# Altium project Biocoin_Motherboard_v1.0.PrjPcb
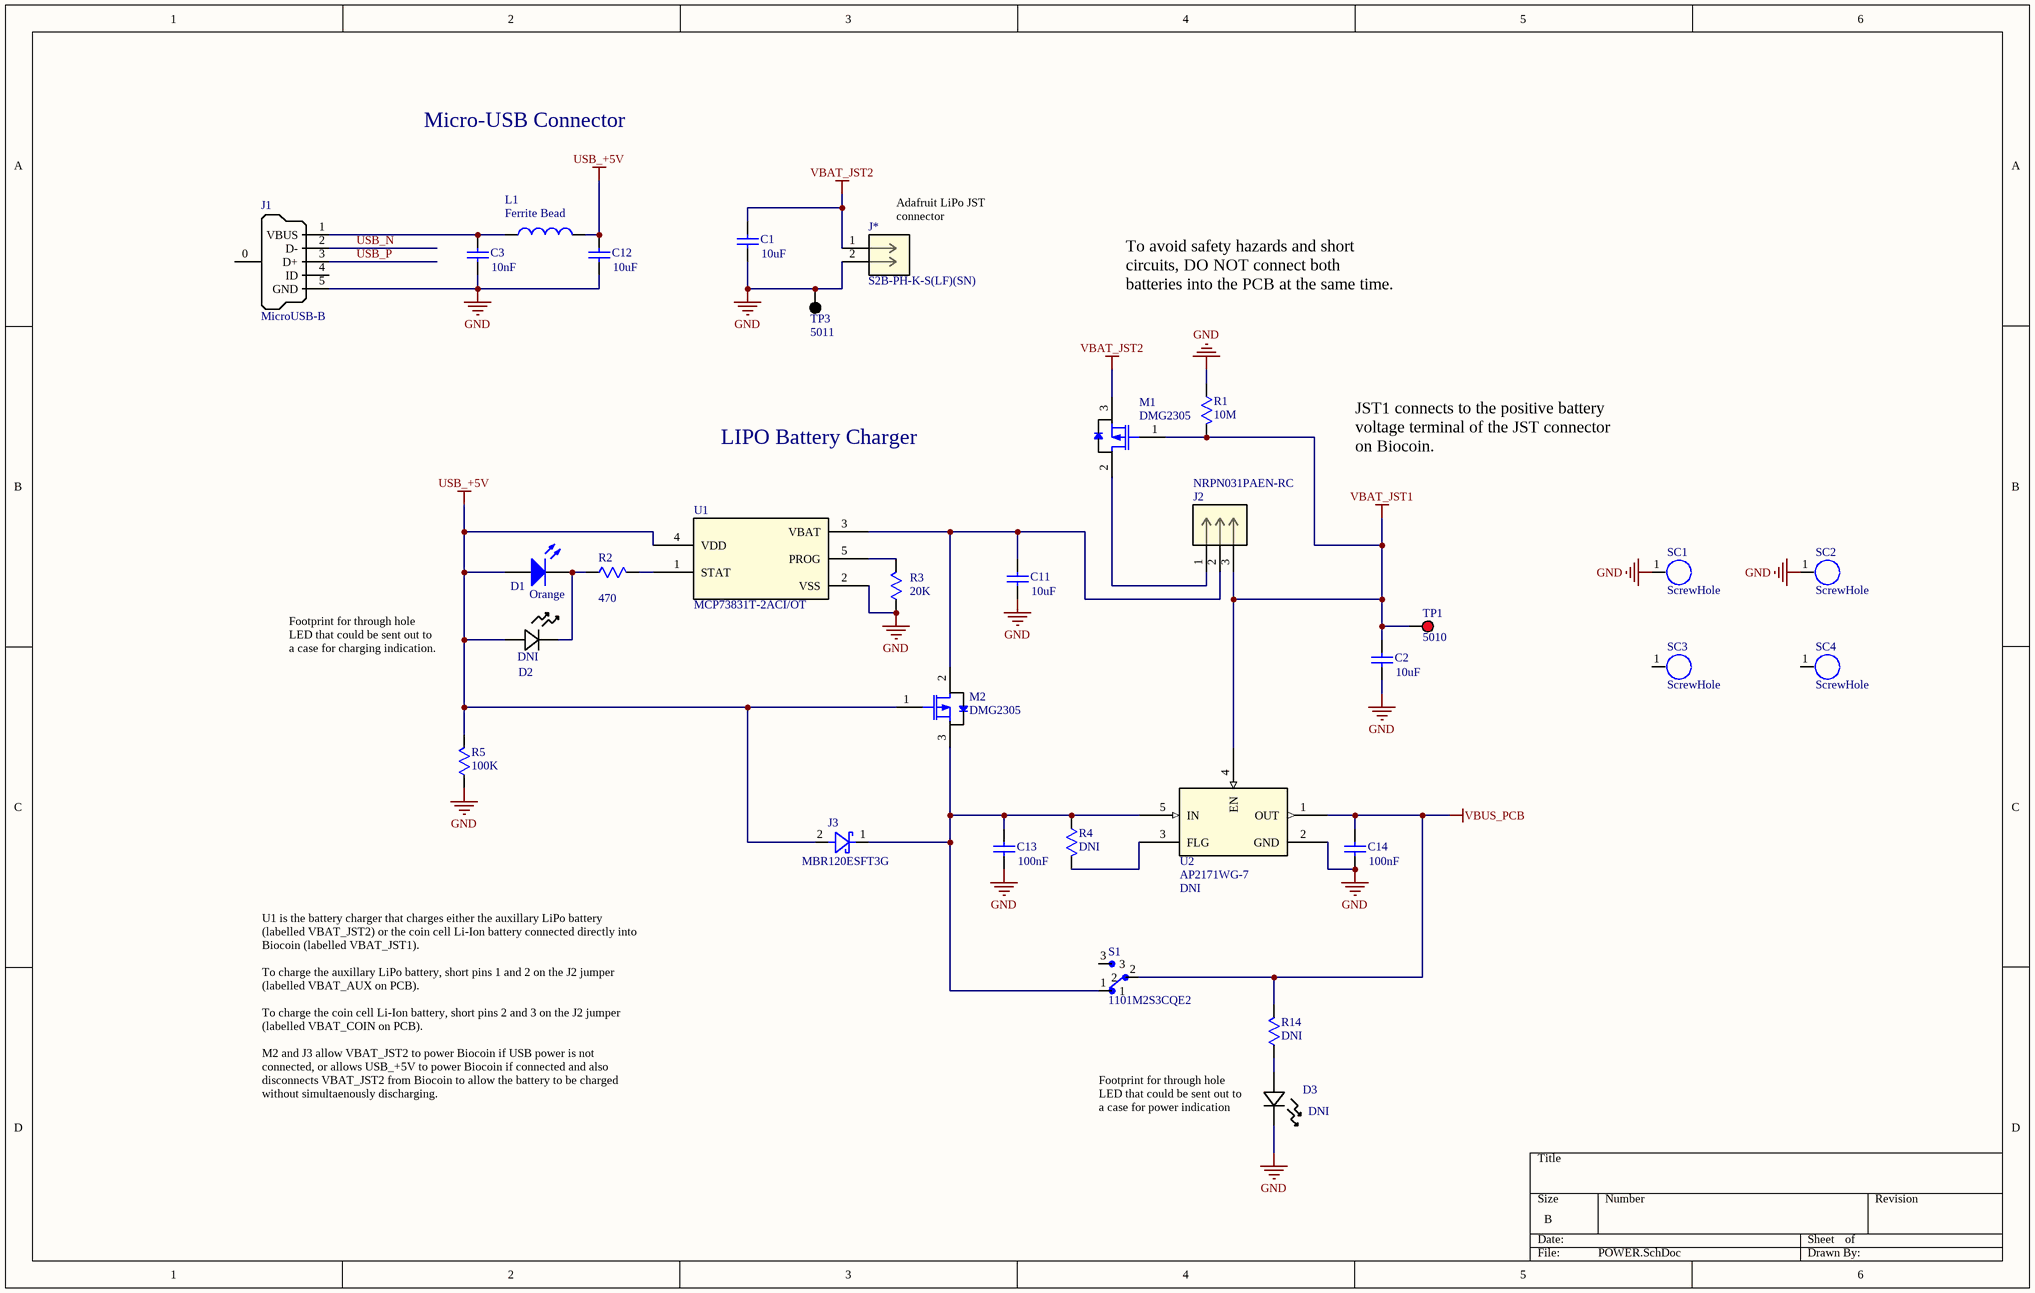
[diagram p0: POWER.SchDoc]
3 sheets, 71 parts. Net scope: global (net labels, ports and power ports of the same name join across sheets).
Board file: Biocoin_Motherboard.PcbDoc
Sheets:
  POWER.SchDoc
  DIGITAL_DATA.SchDoc
  ANALOG_DATA.SchDoc

## Sheet POWER.SchDoc
size B; SheetNumber: 1; SheetTotal: 3

### Parts
C1  value 10uF  [0805-CAP]  (hidden comment: CAP)
C2  value 10uF  [0805-CAP]  (hidden comment: CAP)
C3  value 10nF  [0805-CAP]  (hidden comment: CAP)
C11  value 10uF  [0805-CAP]  (hidden comment: CAP)
C12  value 10uF  [0805-CAP]  (hidden comment: CAP)
C13  value 100nF  [0805-CAP]  (hidden comment: CAP)
C14  value 100nF  [0805-CAP]  (hidden comment: CAP)
D1  Light Color: Orange  [0805-LED]  (hidden comment: LED SMD)
D2  Do Not Install: DNI  [LED_SLI-343D_ROM]  (hidden comment: SLI-343V8RC3F)
D3  Do Not Install: DNI  [LED_SLI-343D_ROM]  (hidden comment: SLI-343V8RC3F)
J1  MicroUSB-B  [MicroUSB-B]
J2  NRPN031PAEN-RC  [CONN_NRPN031_SUL]
J3  MBR120ESFT3G  [SDO_SOD-123FL_ONS-L]
J*  S2B-PH-K-S(LF)(SN)  [CONN_S2B-PH-K-S_JST]
L1  value Ferrite Bead  [0805-IND]  (hidden comment: IND)
M1  DMG2305  [SOT23-3-Lead]
M2  DMG2305  [SOT23-3-Lead]
R1  value 10M  [0805-RES]  (hidden comment: RES)
R2  value 470  [0805-RES]  (hidden comment: RES)
R3  value 20K  [0805-RES]  (hidden comment: RES)
R4  value DNI  [0805-RES]  (hidden comment: RES)
R5  value 100K  [0805-RES]  (hidden comment: RES)
R14  value DNI  [0805-RES]  (hidden comment: RES)
S1  1101M2S3CQE2  [SW_1101M2S3CQE2]
SC1  ScrewHole  [ScrowHole]
SC2  ScrewHole  [ScrowHole]
SC3  ScrewHole  [ScrowHole]
SC4  ScrewHole  [ScrowHole]
TP1  5010  [KSTN-5010_V]
TP3  5011  [KSTN-5011_V]
U1  MCP73831T-2ACI/OT  [SOT23-5]
U2  AP2171WG-7  value DNI  [SOT25_DIO-M]

### Nets
GND: C1.1 C2.1 C3.1 C11.1 C12.1 C13.1 C14.1 D3.1 J1.5(GND) J*.2 R1.1 R3.1 R5.1 SC1.1 SC2.1 TP3.1 U1.2(VSS) U2.2(GND)
USB_+5V: C12.2 D1.1(A) D2.2 J3.2 L1.2 M2.1(G) R5.2 U1.4(VDD)
VBAT_JST1: C2.2 J2.3 M1.1(G) R1.2 TP1.1 U2.4(EN)
VBAT_JST2: C1.2 J*.1 M1.3(D)
VBUS_PCB: C14.2 R14.2 S1.2 U2.1(OUT)
USB_N: J1.2(D-)
USB_P: J1.3(D+)
NetC3_2: C3.2 J1.1(VBUS) L1.1
NetC11_2: C11.2 J2.2 M2.2(S) U1.3(VBAT)
NetC13_2: C13.2 J3.1 M2.3(D) R4.1 S1.1 U2.5(IN)
NetD1_2: D1.2(K) D2.1 R2.1
NetD3_2: D3.2 R14.1
NetJ2_1: J2.1 M1.2(S)
NetR2_2: R2.2 U1.1(STAT)
NetR3_2: R3.2 U1.5(PROG)
NetR4_2: R4.2 U2.3(FLG)

Not connected (* = marked no-connect by the designer): J1 0(Shell) 4(ID); S1 3; SC3 1; SC4 1

### Notes on the sheet
- Micro-USB Connector
- (near J*) Adafruit LiPo JST connector
- To avoid safety hazards and short circuits, DO NOT connect both batteries into the PCB at the same time.
- LIPO Battery Charger
- JST1 connects to the positive battery voltage terminal of the JST connector on Biocoin.
- Footprint for through hole LED that could be sent out to a case for charging indication.
- U1 is the battery charger that charges either the auxillary LiPo battery (labelled VBAT_JST2) or the coin cell Li-Ion battery connected directly into Biocoin (labelled VBAT_JST1).
  To charge the auxillary LiPo battery, short pins 1 and 2 on the J2 jumper (labelled VBAT_AUX on PCB).
  To charge the coin cell Li-Ion battery, short pins 2 and 3 on the J2 jumper (labelled VBAT_COIN on PCB).
  M2 and J3 allow VBAT_JST2 to power Biocoin if USB power is not connected, or allows USB_+5V to power Biocoin if connected and also disconnects VBAT_JST2 from Biocoin to allow the battery to be charged without simultaenously discharging.
- Footprint for through hole LED that could be sent out to a case for power indication

### Library data of the parts
C1-C3 C11-C14 = CAP SMD: Multilayer Chip Capacitor; Designer: OMIGA
D1 = LED SMD: Surface Mount Light Emitting Diode
D2 D3 = SLI-343V8RC3F: No Description Available; Vendor: ROHM Semiconductor; Built_By: EMA_Matt; SourceLibrary: Rohm_2019-09-23; Manufacturer_Part_Number: SLI-343V8RC3F; Copyright: Copyright (C) 2018 Accelerated Designs. All rights reserved; Parameter 2: *
J1 = MicroUSB-B: Conn Micro USB Type B RCP 5; Designer: OMIGA
J2 = NRPN031PAEN-RC: No Description Available; Mfr_Name: Sullins; Copyright: Copyright (C) 2022 Ultra Librarian. All rights reserved.; Manufacturer_Part_Number: NRPN031PAEN-RC; Digi-Key_Part_Number_1: S5800-03-ND; RefDes: RefDes; Type: DEV
J3 = SCHOTTKY: Diode Schottky 1A Surface Mount SOD-123FL
J* = S2B-PH-K-S(LF)(SN): Connector Header Through Hole, Right Angle 2 position 0.079" (2.00mm)
L1 = IND SMD: Surface Mount Inductor; Designer: OMIGA
M1 M2 = PMOS: P-Channel MOSFET DMG2305UX-13; Designer: OMIGA
R1-R5 R14 = RES SMD: Surface Mount Resistor; Designer: OMIGA
S1 = 1101M2S3CQE2: Slide Switch SPDT Through Hole; MF: C&K; SnapEDA_Link: https://www.snapeda.com/parts/1101M2S3CQE2/C%26K/view-part/287375/?ref=snap; MP: 1101M2S3CQE2; Value: *; Digi-Key_Part_Number: CKN5001-ND; Digi-Key_Purchase_URL: https://www.digikey.fr/product-detail/en/c-k/1101M2S3CQE2/CKN5001-ND/67042?utm_source=snapeda&utm_medium=aggregator&utm_campaign=symbol; Package: None
SC1-SC4 = ScrewHole: Scrow Hole; Designer: OMIGA
TP1 = Test Point Red: PC TEST POINT MULTIPURPOSE RED
TP3 = Test Point Black: PC TEST POINT MULTIPURPOSE BLACK
U1 = MCP73831T-2ACI/OT: Charger IC Lithium Ion/Polymer SOT-23-5
U2 = AP2171WG-7: No Description Available; Mfr_Name: Diodes Inc; Copyright: Copyright (C) 2022 Ultra Librarian. All rights reserved.; Manufacturer_Part_Number: AP2171WG-7; Digi-Key_Part_Number_1: AP2171WGDICT-ND; Digi-Key_Part_Number_2: AP2171WGDIDKR-ND; Digi-Key_Part_Number_3: AP2171WGDITR-ND; RefDes: RefDes; Type: DEV

## Sheet DIGITAL_DATA.SchDoc
size B; SheetNumber: 2; SheetTotal: 3
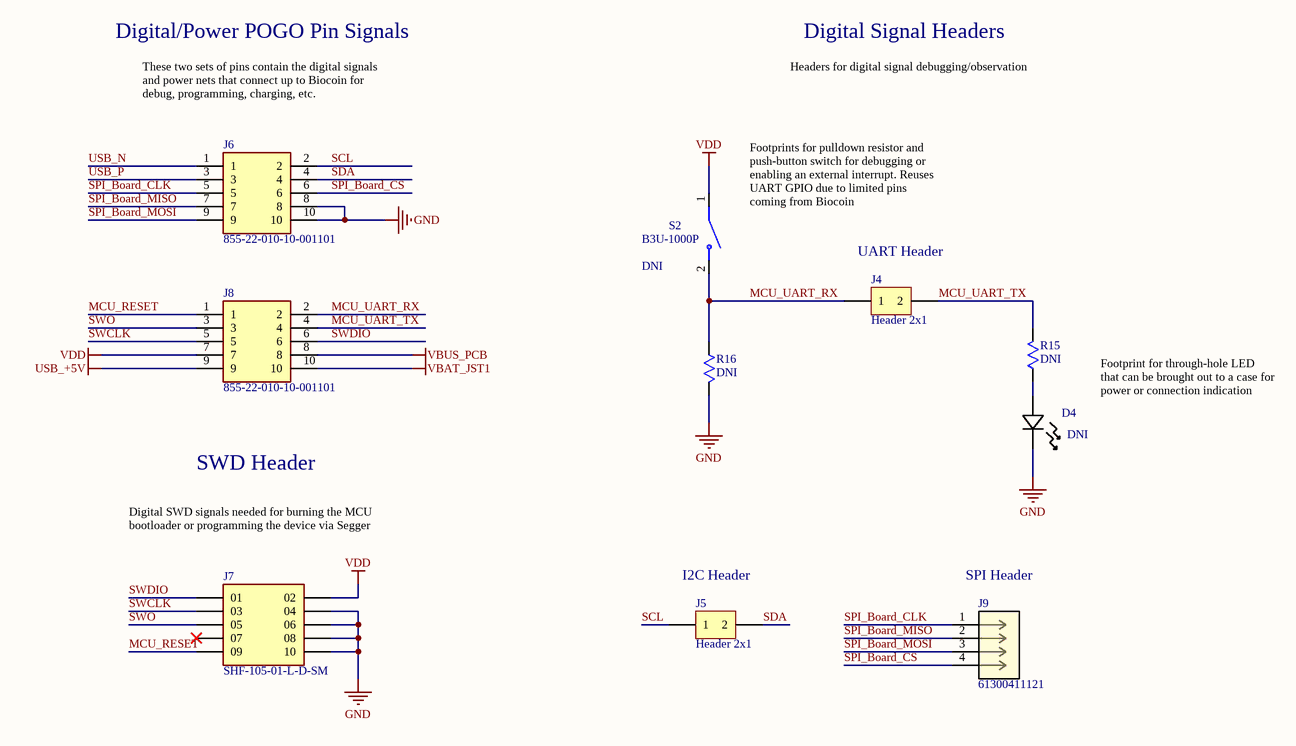
[diagram p1: DIGITAL_DATA.SchDoc]

### Parts
D4  Do Not Install: DNI  [LED_SLI-343D_ROM]  (hidden comment: SLI-343V8RC3F)
J4  Header 2x1  [Header 1x2]
J5  Header 2x1  [Header 1x2]
J6  855-22-010-10-001101  [HDRV10W41P127_2X5_927X300X627P]
J7  SHF-105-01-L-D-SM  [SAMTEC_SHF-105-01-L-D-SM]
J8  855-22-010-10-001101  [HDRV10W41P127_2X5_927X300X627P]
J9  61300411121  [CONN_61300411121_WRE]
R15  value DNI  [0805-RES]  (hidden comment: RES)
R16  value DNI  [0805-RES]  (hidden comment: RES)
S2  B3U-1000P  Do Not Install: DNI  [SW_B3U-1000P]

### Nets
GND: D4.1 J6.8 J6.10 J7.04 J7.06 J7.08 J7.10 R16.2
USB_+5V: J8.9
VBAT_JST1: J8.10
VBUS_PCB: J8.8
VDD: J7.02 J8.7 S2.1
MCU_RESET: J7.09 J8.1
MCU_UART_RX: J4.1 J8.2 R16.1 S2.2
MCU_UART_TX: J4.2 J8.4 R15.2
SCL: J5.1 J6.2
SDA: J5.2 J6.4
SPI_Board_CLK: J6.5 J9.1
SPI_Board_CS: J6.6 J9.4
SPI_Board_MISO: J6.7 J9.2
SPI_Board_MOSI: J6.9 J9.3
SWCLK: J7.03 J8.5
SWDIO: J7.01 J8.6
SWO: J7.05 J8.3
USB_N: J6.1
USB_P: J6.3
NetD4_2: D4.2 R15.1

Not connected (* = marked no-connect by the designer): J7 07*

### Notes on the sheet
- Digital/Power POGO Pin Signals
- Digital Signal Headers
- These two sets of pins contain the digital signals and power nets that connect up to Biocoin for debug, programming, charging, etc.
- Headers for digital signal debugging/observation
- (near S2) Footprints for pulldown resistor and push-button switch for debugging or enabling an external interrupt. Reuses UART GPIO due to limited pins coming from Biocoin
- (near J4) UART Header
- Footprint for through-hole LED that can be brought out to a case for power or connection indication
- SWD Header
- Digital SWD signals needed for burning the MCU bootloader or programming the device via Segger
- (near J5) I2C Header
- (near J9) SPI Header

### Library data of the parts
D4 = SLI-343V8RC3F: as D2 on sheet POWER; Manufacturer_Part_Number: SLI-343V8RC3F; Copyright: Copyright (C) 2018 Accelerated Designs. All rights reserved; Parameter 2: *
J4 J5 = Header 2x1: Pin Header 2x1; Designer: OMIGA
J6 J8 = 10 pin Pogo Pin Male Header: Manufacturer_Name: Mill-Max; Datasheet Link: https://www.mill-max.com/products/socket/855-XX-XXX-10-001101/855-22-010-10-001101; Height: 6.274mm; Manufacturer_Part_Number: 855-22-010-10-001101
J7 = SHF-105-01-L-D-SM: SHF - Samtec Wire-to-Board 1.27mm Surface Mount Shrouded Header; Value: *; Package: None; SnapEDA_Link: https://www.snapeda.com/parts/SHF-105-01-L-D-SM/Samtec+Inc./view-part/?ref=snap; MF: Samtec; Check_prices: https://www.snapeda.com/parts/SHF-105-01-L-D-SM/Samtec+Inc./view-part/?ref=eda; Digi-Key_Part_Number: SAM10710-ND; MP: SHF-105-01-L-D-SM; Purchase-URL: https://pricing.snapeda.com/search/part/SHF-105-01-L-D-SM/?ref=eda
J9 = Header 4x1: CONN HEADER VERT 4POS 2.54MM
R15 R16 = RES SMD: Surface Mount Resistor; Designer: OMIGA
S2 = Pushbutton Small: SWITCH TACTILE SPST-NO 0.05A 12V

## Sheet ANALOG_DATA.SchDoc
size B; SheetNumber: 3; SheetTotal: 3
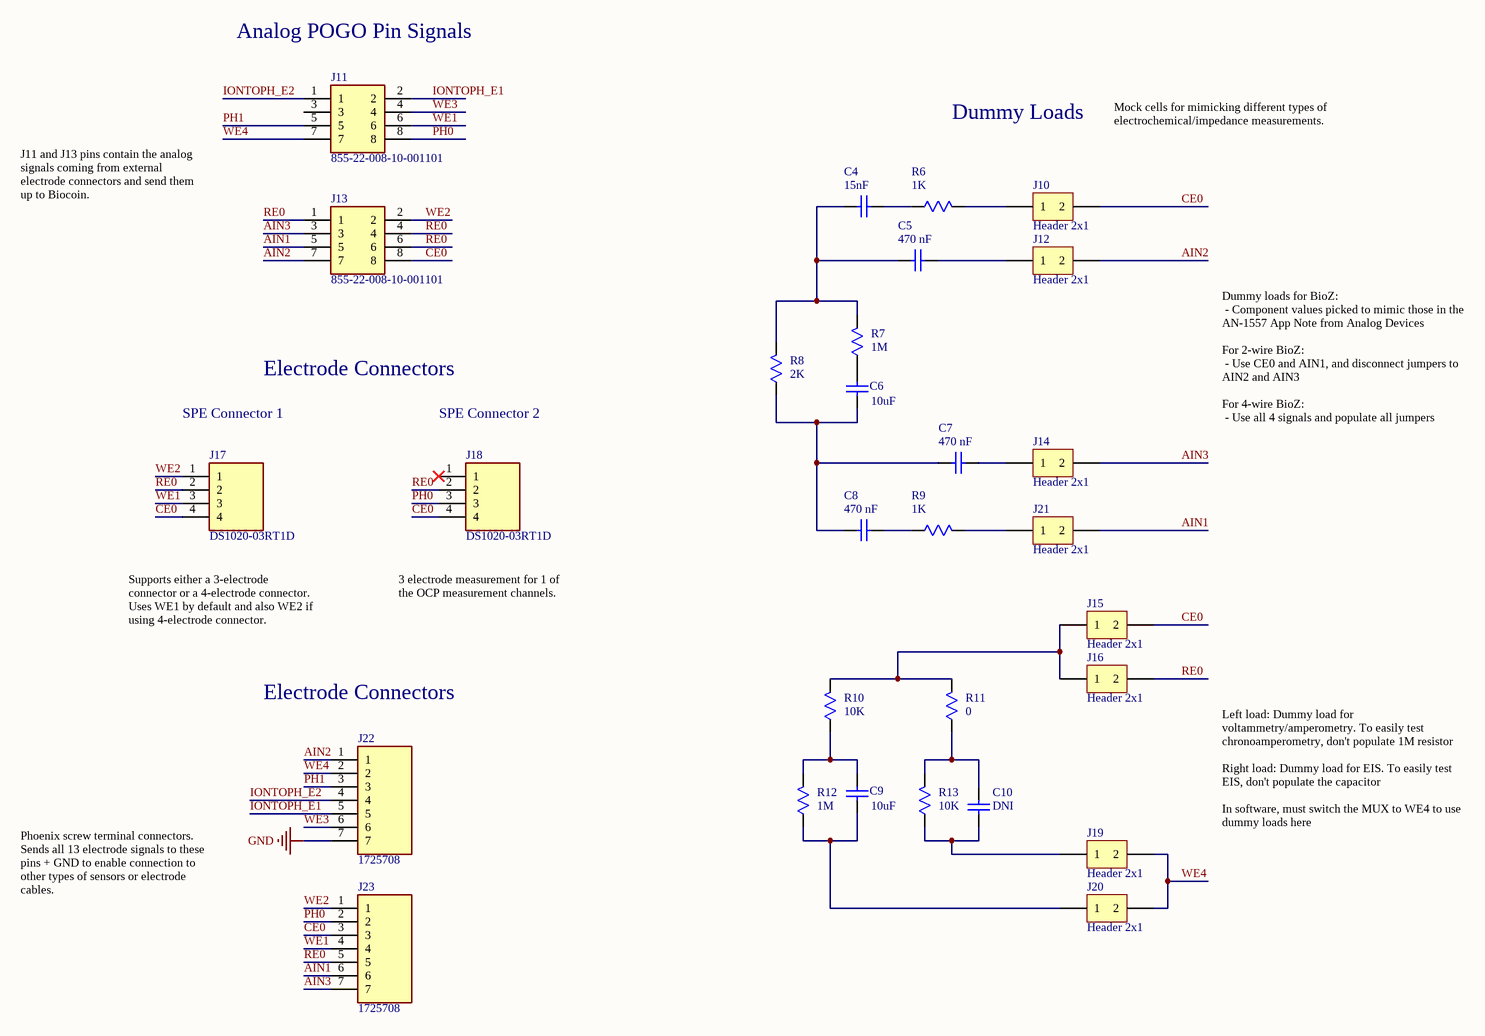
[diagram p2: ANALOG_DATA.SchDoc]

### Parts
C4  value 15nF  [0805-CAP]  (hidden comment: CAP)
C5  value 470 nF  [0805-CAP]  (hidden comment: CAP)
C6  value 10uF  [0805-CAP]  (hidden comment: CAP)
C7  value 470 nF  [0805-CAP]  (hidden comment: CAP)
C8  value 470 nF  [0805-CAP]  (hidden comment: CAP)
C9  value 10uF  [0805-CAP]  (hidden comment: CAP)
C10  value DNI  [0805-CAP]  (hidden comment: CAP)
J10  Header 2x1  [Header 1x2]
J11  855-22-008-10-001101  [8552200810001101]
J12  Header 2x1  [Header 1x2]
J13  855-22-008-10-001101  [8552200810001101]
J14  Header 2x1  [Header 1x2]
J15  Header 2x1  [Header 1x2]
J16  Header 2x1  [Header 1x2]
J17  DS1020-03RT1D  [55203144-2]
J18  DS1020-03RT1D  [55203144-2]
J19  Header 2x1  [Header 1x2]
J20  Header 2x1  [Header 1x2]
J21  Header 2x1  [Header 1x2]
J22  1725708  [1725708]
J23  1725708  [1725708]
R6  value 1K  [0805-RES]  (hidden comment: RES)
R7  value 1M  [0805-RES]  (hidden comment: RES)
R8  value 2K  [0805-RES]  (hidden comment: RES)
R9  value 1K  [0805-RES]  (hidden comment: RES)
R10  value 10K  [0805-RES]  (hidden comment: RES)
R11  value 0  [0805-RES]  (hidden comment: RES)
R12  value 1M  [0805-RES]  (hidden comment: RES)
R13  value 10K  [0805-RES]  (hidden comment: RES)

### Nets
GND: J22.7
AIN1: J13.5 J21.2 J23.6
AIN2: J12.2 J13.7 J22.1
AIN3: J13.3 J14.2 J23.7
CE0: J10.2 J13.8 J15.2 J17.4 J18.4 J23.3
IONTOPH_E1: J11.2 J22.5
IONTOPH_E2: J11.1 J22.4
PH0: J11.8 J18.3 J23.2
PH1: J11.5 J22.3
RE0: J13.1 J13.4 J13.6 J16.2 J17.2 J18.2 J23.5
WE1: J11.6 J17.3 J23.4
WE2: J13.2 J17.1 J23.1
WE3: J11.4 J22.6
WE4: J11.7 J19.2 J20.2 J22.2
NetC4_1: C4.1 C5.1 R7.2 R8.2
NetC4_2: C4.2 R6.1
NetC5_2: C5.2 J12.1
NetC6_1: C6.1 C7.1 C8.1 R8.1
NetC6_2: C6.2 R7.1
NetC7_2: C7.2 J14.1
NetC8_2: C8.2 R9.1
NetC9_1: C9.1 J20.1 R12.1
NetC9_2: C9.2 R10.1 R12.2
NetC10_1: C10.1 J19.1 R13.1
NetC10_2: C10.2 R11.1 R13.2
NetJ10_1: J10.1 R6.2
NetJ15_1: J15.1 J16.1 R10.2 R11.2
NetJ21_1: J21.1 R9.2

Not connected (* = marked no-connect by the designer): J11 3; J18 1*

### Notes on the sheet
- Analog POGO Pin Signals
- Dummy Loads
- Mock cells for mimicking different types of electrochemical/impedance measurements.
- J11 and J13 pins contain the analog signals coming from external electrode connectors and send them up to Biocoin.
- SPE Connector 1
- Electrode Connectors
- SPE Connector 2
- Dummy loads for BioZ:
  - Component values picked to mimic those in the AN-1557 App Note from Analog Devices
  For 2-wire BioZ:
  - Use CE0 and AIN1, and disconnect jumpers to AIN2 and AIN3
  For 4-wire BioZ:
  - Use all 4 signals and populate all jumpers
- Supports either a 3-electrode connector or a 4-electrode connector. Uses WE1 by default and also WE2 if using 4-electrode connector.
- 3 electrode measurement for 1 of the OCP measurement channels.
- Phoenix screw terminal connectors. Sends all 13 electrode signals to these pins + GND to enable connection to other types of sensors or electrode cables.
- Left load: Dummy load for voltammetry/amperometry. To easily test chronoamperometry, don't populate 1M resistor
  Right load: Dummy load for EIS. To easily test EIS, don't populate the capacitor
  In software, must switch the MUX to WE4 to use dummy loads here

### Library data of the parts
C4-C10 = CAP SMD: as C1 on sheet POWER
J10 J12 J14-J16 J19-J21 = Header 2x1: Pin Header 2x1; Designer: OMIGA
J11 J13 = 8 pin Pogo Pin Male Header: Manufacturer_Name: Mill-Max; Datasheet Link: https://componentsearchengine.com/Datasheets/2/855-22-008-10-001101.pdf; Height: 6.27mm; Manufacturer_Part_Number: 855-22-008-10-001101
J17 J18 = SPE Connector 3 pin: 3 pin right angle SPE connector. Can also use the 5-520315-3-ND
J22 J23 = 1725708: Connector; Manufacturer_Name: Phoenix Contact; Datasheet Link: https://www.phoenixcontact.com/online/portal/us/?uri=pxc-oc-itemdetail:pid=1725708&library=usen&pcck=P-11-01-05&tab=1&selectedCategory=ALL; Height: 8.65mm; Manufacturer_Part_Number: 1725708
R6-R13 = RES SMD: Surface Mount Resistor; Designer: OMIGA

## Nets that join several sheets
GND: POWER (18 pins), DIGITAL_DATA (8 pins), ANALOG_DATA (J22.7)
USB_+5V: POWER (8 pins), DIGITAL_DATA (J8.9)
VBAT_JST1: POWER (6 pins), DIGITAL_DATA (J8.10)
VBUS_PCB: POWER (C14.2 R14.2 S1.2 U2.1), DIGITAL_DATA (J8.8)
USB_N: POWER (J1.2), DIGITAL_DATA (J6.1)
USB_P: POWER (J1.3), DIGITAL_DATA (J6.3)